# Altium schematic sheet DP_MCP4651.SchDoc
size A4
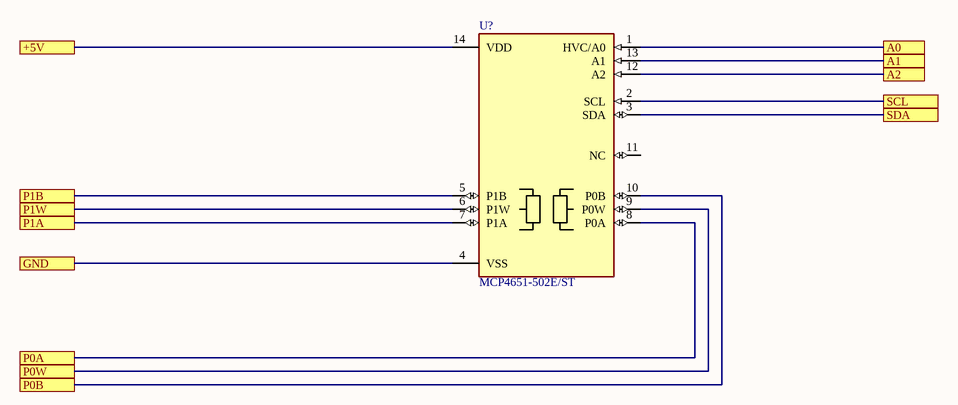
[diagram p0: DP_MCP4651.SchDoc]

## Parts
U?  MCP4651-502E/ST  [TSSOP-14]

## Ports
+5V, A0, A1, A2, GND, P0A, P0B, P0W, P1A, P1B, P1W, SCL, SDA

## Nets
+5V: U?.14(VDD) ; port +5V
A0: U?.1(HVC/A0) ; port A0
A1: U?.13(A1) ; port A1
A2: U?.12(A2) ; port A2
GND: U?.4(VSS) ; port GND
P0A: U?.8(P0A) ; port P0A
P0B: U?.10(P0B) ; port P0B
P0W: U?.9(P0W) ; port P0W
P1A: U?.7(P1A) ; port P1A
P1B: U?.5(P1B) ; port P1B
P1W: U?.6(P1W) ; port P1W
SCL: U?.2(SCL) ; port SCL
SDA: U?.3(SDA) ; port SDA

Not connected (* = marked no-connect by the designer): U? 11(NC)

## Library data of the parts
U? = MCP4651: Digital Potentiometr; Manufacturer: Microchip; SpecificationName: IC; Package: None; Price: None; Value: *; MP: MCP4651-502E/ST; Availability: Unavailable; Part Number: MCP4651; Author: Sun; DateModification: 14.02.2022; ManufacturerPartNumber: MCP4651; Корпус: TSSOP-14